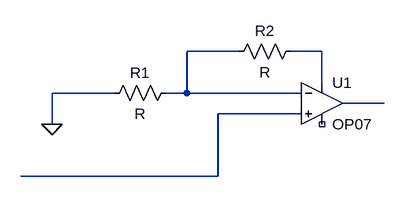
[diagram p0: schematic Draft1.asc]
Draft1.asc, the LTspice schematic file:
Version 4
SHEET 1 880 680
WIRE 80 48 0 48
WIRE 208 48 160 48
WIRE 208 96 208 48
WIRE -112 112 -208 112
WIRE 0 112 0 48
WIRE 0 112 -32 112
WIRE 176 112 0 112
WIRE 304 128 240 128
WIRE 176 144 48 144
WIRE -208 160 -208 112
WIRE 48 240 48 144
WIRE 48 240 -256 240
FLAG -208 160 0
SYMBOL OpAmps\\OP07 208 64 R0
SYMATTR InstName U1
SYMBOL res 64 64 R270
WINDOW 0 32 56 VTop 2
WINDOW 3 0 56 VBottom 2
SYMATTR InstName R2
SYMBOL res -128 128 R270
WINDOW 0 32 56 VTop 2
WINDOW 3 0 56 VBottom 2
SYMATTR InstName R1

The netlist it stands for:
* Draft1.asc
XU1 N004 N001 N002 NC_01 N003 LT1001  ; OP07, pins In+ In- V+ V- OUT
R2 N001 N002 R
R1 0 N001 R
.lib LTC.lib
.backanno
.end